# EAGLE design card (EAGLE 7.7.0)
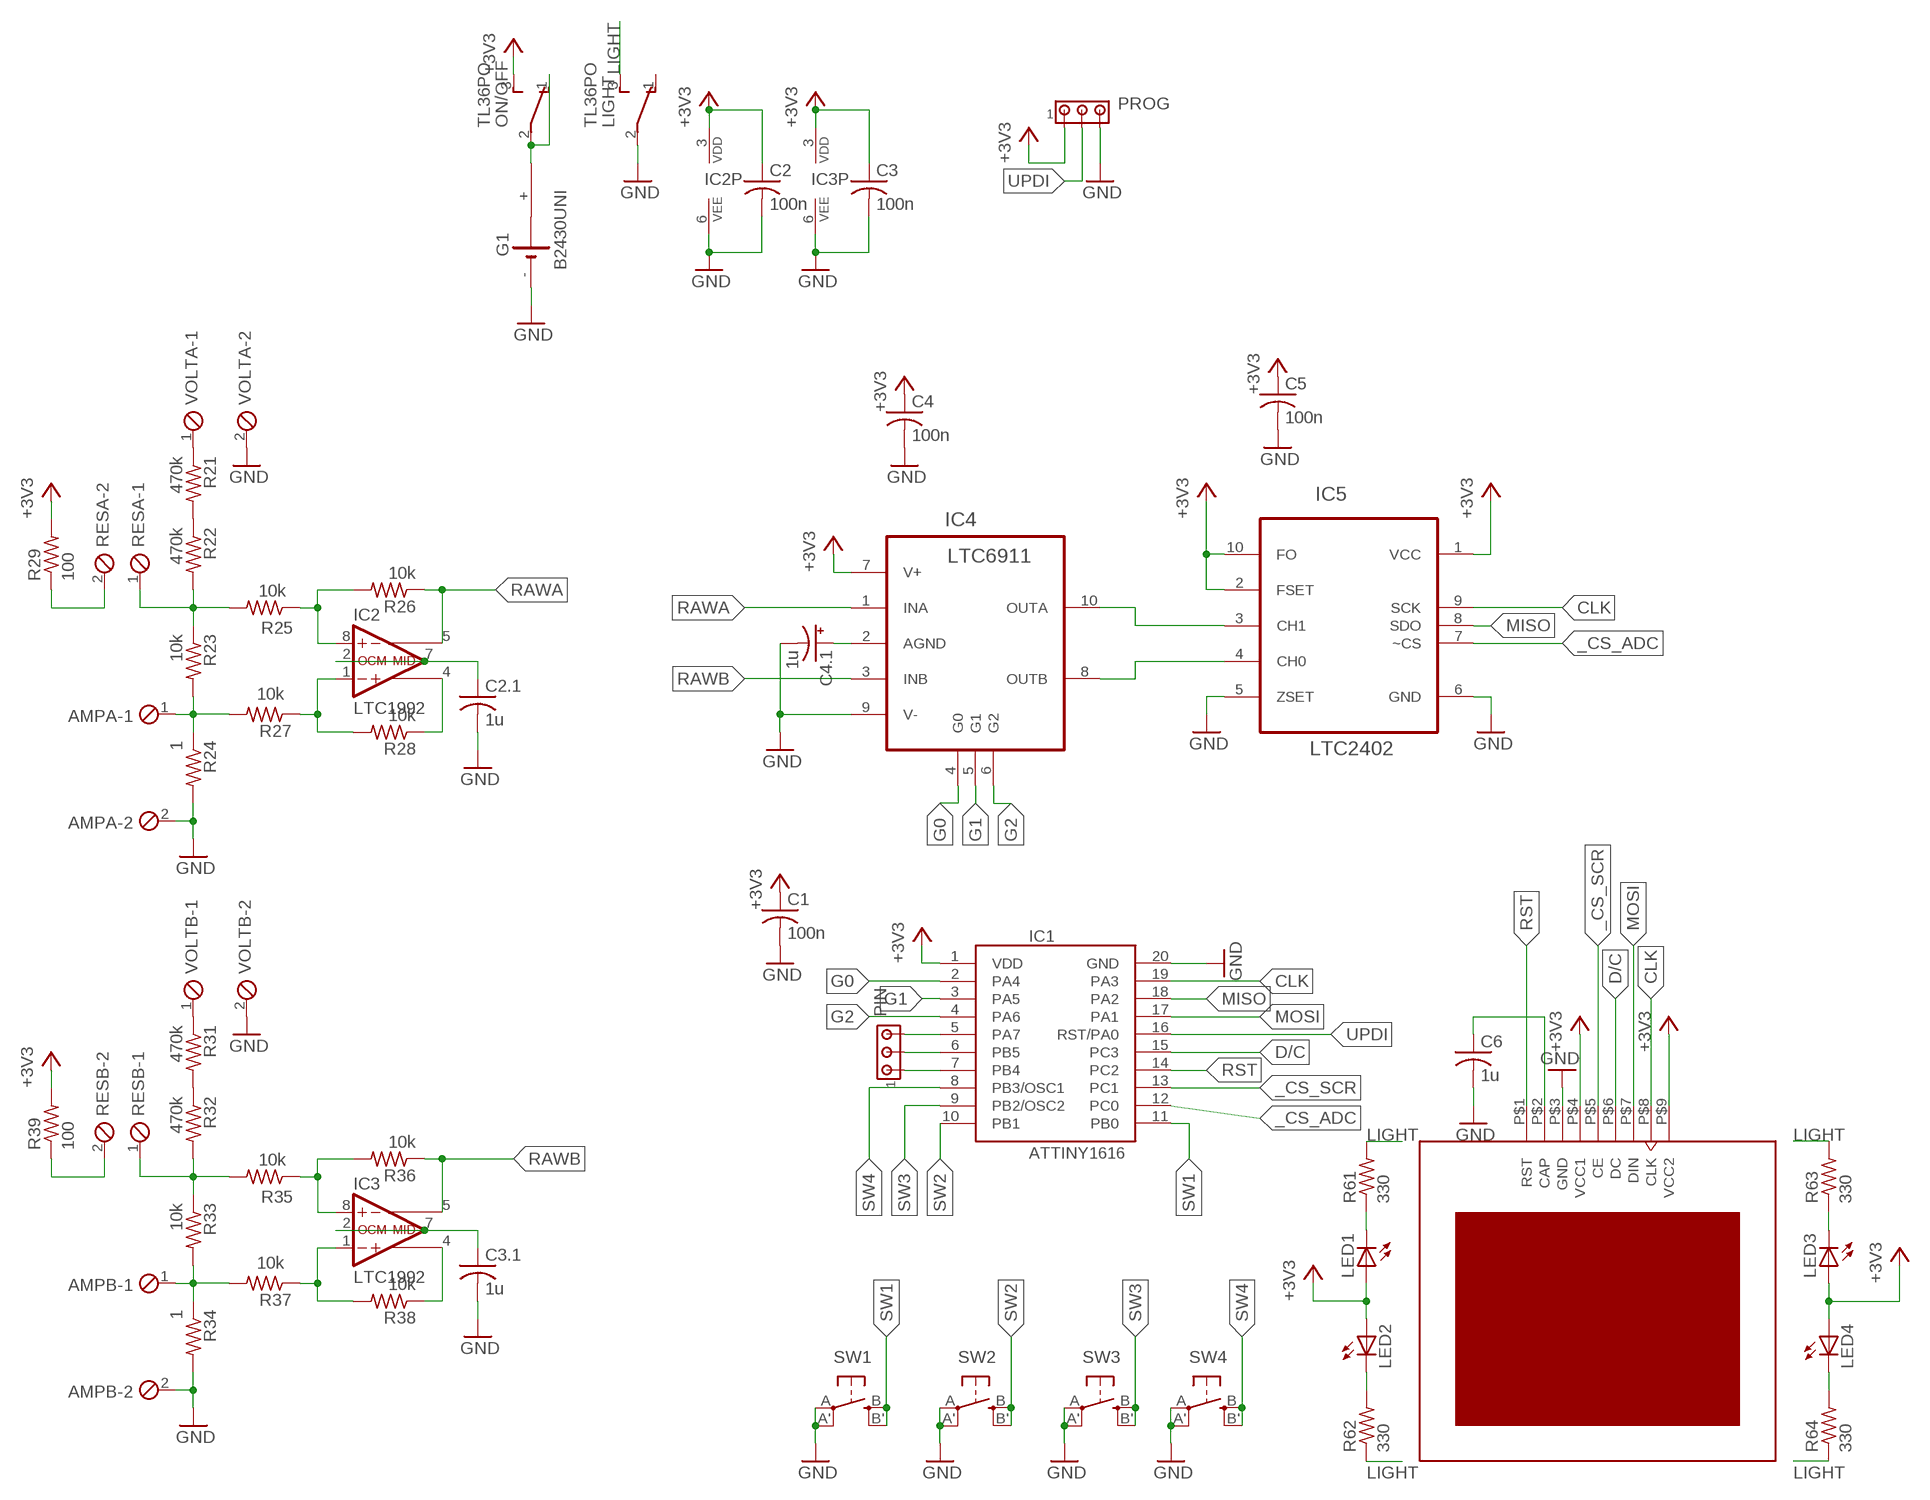
[diagram p0: schematic, sheet 1]

## Parts
AMPA  MPT2  [2POL254]
AMPB  MPT2  [2POL254]
C1  100n  C-USC0805K  [C0805K]
C2  100n  C-USC0805K  [C0805K]
C2.1  1u  C-USC0805  [C0805]
C3  100n  C-USC0805K  [C0805K]
C3.1  1u  C-USC0805  [C0805]
C4  100n  C-USC0805K  [C0805K]
C4.1  1u  CPOL-USA/3216-18R  [A/3216-18R]
C5  100n  C-USC0805K  [C0805K]
C6  1u  C-USC0805  [C0805]
G1  B2430UNI  [B2430UNI]
IC1  ATTINY1616  [SO20W]
IC2  LTC1992  LTC1992CMS8  [MSOP8]
IC3  LTC1992  LTC1992CMS8  [MSOP8]
IC4  LTC6911  LTC6911CMS-1  [MSOP10]
IC5  LTC2402  LTC2402CMS  [MSOP10]
LED1  LEDCHIP-LED0805  [CHIP-LED0805]
LED2  LEDCHIP-LED0805  [CHIP-LED0805]
LED3  LEDCHIP-LED0805  [CHIP-LED0805]
LED4  LEDCHIP-LED0805  [CHIP-LED0805]
LIGHT  TL36PO  [TL3XPO]
ON/OFF  TL36PO  [TL3XPO]
PIN  MTA03-100  [10X03MTA]
PROG  MTA03-100  [10X03MTA]
R21  470k  R-US_M0805  [M0805]
R22  470k  R-US_M0805  [M0805]
R23  10k  R-US_M0805  [M0805]
R24  1  R-US_M0805  [M0805]
R25  10k  R-US_M0805  [M0805]
R26  10k  R-US_M0805  [M0805]
R27  10k  R-US_M0805  [M0805]
R28  10k  R-US_M0805  [M0805]
R29  100  R-US_M0805  [M0805]
R31  470k  R-US_M0805  [M0805]
R32  470k  R-US_M0805  [M0805]
R33  10k  R-US_M0805  [M0805]
R34  1  R-US_M0805  [M0805]
R35  10k  R-US_M0805  [M0805]
R36  10k  R-US_M0805  [M0805]
R37  10k  R-US_M0805  [M0805]
R38  10k  R-US_M0805  [M0805]
R39  100  R-US_M0805  [M0805]
R61  330  R-US_M0805  [M0805]
R62  330  R-US_M0805  [M0805]
R63  330  R-US_M0805  [M0805]
R64  330  R-US_M0805  [M0805]
RESA  MPT2  [2POL254]
RESB  MPT2  [2POL254]
SW1  SPST_TACT-EVQQ2  [EVQ-Q2]
SW2  SPST_TACT-EVQQ2  [EVQ-Q2]
SW3  SPST_TACT-EVQQ2  [EVQ-Q2]
SW4  SPST_TACT-EVQQ2  [EVQ-Q2]
U$1  NOKIA_SCREEN  [NOKIA_SCREEN]
VOLTA  MPT2  [2POL254]
VOLTB  MPT2  [2POL254]

## Nets
+3V3: C1.1 C2.1 C3.1 C4.1 C5.1 IC1.1(VDD) IC2.3(VDD) IC3.3(VDD) IC4.7(V+) IC5.1(VCC) IC5.2(FSET) IC5.10(FO) LED1.A LED2.A LED3.A LED4.A ON/OFF.3(S) PROG.1 R29.2 R39.2 U$1.P$4(VCC1) U$1.P$9(VCC2)
_CS_ADC: IC1.12(PC0) IC5.7(~CS)
_CS_SCR: IC1.13(PC1) U$1.P$5(CE)
CLK: IC1.19(PA3) IC5.9(SCK) U$1.P$8(CLK)
D/C: IC1.15(PC3) U$1.P$6(DC)
G0: IC1.2(PA4) IC4.4(G0)
G1: IC1.3(PA5) IC4.5(G1)
G2: IC1.4(PA6) IC4.6(G2)
GND: AMPA.2 AMPB.2 C1.2 C2.1.2 C2.2 C3.1.2 C3.2 C4.1.- C4.2 C5.2 C6.2 G1.- IC1.20(GND) IC2.6(VEE) IC3.6(VEE) IC4.9(V-) IC5.5(ZSET) IC5.6(GND) LIGHT.2(P) PROG.3 R24.2 R34.2 SW1.A'(P1) SW1.A(P) SW2.A'(P1) SW2.A(P) SW3.A'(P1) SW3.A(P) SW4.A'(P1) SW4.A(P) U$1.P$3(GND) VOLTA.2 VOLTB.2
LIGHT: LIGHT.3(S) R61.2 R62.1 R63.2 R64.1
MISO: IC1.18(PA2) IC5.8(SDO)
MOSI: IC1.17(PA1) U$1.P$7(DIN)
N$1: G1.+ ON/OFF.1(O) ON/OFF.2(P)
N$2: LED1.C R61.1
N$3: C6.1 U$1.P$2(CAP)
N$4: LED2.C R62.2
N$5: LED4.C R64.2
N$6: LED3.C R63.1
N$7: IC1.7(PB4) PIN.1
N$8: IC1.5(PA7) PIN.3
N$9: IC1.6(PB5) PIN.2
N$16: IC2.1(-IN) R27.1 R28.2
N$17: IC2.8(+IN) R25.1 R26.2
N$18: C4.1.+ IC4.2(AGND)
N$19: IC2.4(+OUT) R28.1
N$21: C2.1.1 IC2.2(OCM) IC2.7(MID)
N$22: R21.2 R22.1
N$23: R22.2 R23.1 R25.2 RESA.1
N$24: AMPA.1 R23.2 R24.1 R27.2
N$25: IC3.1(-IN) R37.1 R38.2
N$26: IC3.8(+IN) R35.1 R36.2
N$27: R21.1 VOLTA.1
N$28: R29.1 RESA.2
N$29: IC4.8(OUTB) IC5.4(CH0)
N$30: IC3.4(+OUT) R38.1
N$31: C3.1.1 IC3.2(OCM) IC3.7(MID)
N$32: R31.2 R32.1
N$33: R32.2 R33.1 R35.2 RESB.1
N$34: AMPB.1 R33.2 R34.1 R37.2
N$35: R31.1 VOLTB.1
N$36: R39.1 RESB.2
N$37: IC4.10(OUTA) IC5.3(CH1)
RAWA: IC2.5(-OUT) IC4.1(INA) R26.1
RAWB: IC3.5(-OUT) IC4.3(INB) R36.1
RST: IC1.14(PC2) U$1.P$1(RST)
SW1: IC1.11(PB0) SW1.B'(S1) SW1.B(S)
SW2: IC1.10(PB1) SW2.B'(S1) SW2.B(S)
SW3: IC1.9(PB2/OSC2) SW3.B'(S1) SW3.B(S)
SW4: IC1.8(PB3/OSC1) SW4.B'(S1) SW4.B(S)
UPDI: IC1.16(RST/PA0) PROG.2
Unconnected: G1.+@1(+) G1.+@2(+) G1.+@3(+) G1.+@4(+) G1.-@1(-) LIGHT.1(O)

## Library data of the parts
AMPA AMPB RESA RESB VOLTA VOLTB = con-phoenix-254:MPT2: PHOENIX CONNECTOR; OC_FARNELL: unknown; OC_NEWARK: unknown
C1-C5 = adafruit:C-US: CAPACITOR, American symbol
C2.1 C3.1 C6 = resistor:C-US: CAPACITOR, American symbol
C4.1 = adafruit:CPOL-US: POLARIZED CAPACITOR, American symbol
G1 = battery:B2430UNI: LI BATTERY
IC1 = HomeMade:ATTINY1616
IC2 IC3 = linear-technology-2:LTC1992*: Low Power, Fully Differential Input/Output Amplifier/Driver
IC4 = HomeMade:LTC6911CMS-1
IC5 = HomeMade:LTC2402CMS
LED1-LED4 = adafruit:LED: LED OSRAM: - CHIPLED LG R971, LG N971, LY N971, LG Q971, LY Q971, LO R971, LY R971 LH N974, LH R974 LS Q976, LO Q976, LY Q976 LO Q996 - Hyper CHIPLED LW Q18S LB Q993, LB Q99A, LB R99A - SideLED LS A670, LO A670, LY A670, LG A670, LP A670 LB A673, LV A673, LT A673, LW A673 LH A674 LY A675 LS A676, LA A676, LO A676, LY A676, LW A676 LS A679, LY A679, LG A679 - Hyper Micro SIDELED® LS Y876, LA Y876, LO Y876, LY Y876 LT Y87S - SmartLED LW L88C, LW L88S LB L89C, LB L89S, LG L890 LS L89K, LO L89K, LY L89K LS L896, LA L896, LO L896, LY L896 - TOPLED LS T670, LO T670, LY T670, LG T670, LP T670 LSG T670, LSP T670, LSY T670, LOP T670, LYG T670 LG T671, LOG T671, LSG T671 LB T673, LV T673, LT T673, LW T673 LH T674 LS T676, LA T676, LO T676, LY T676, LB T676, LH T676, LSB T676, LW T676 LB T67C, LV T67C, LT T67C, LS T67K, LO T67K, LY T67K, LW E67C LS E67B, LA E67B, LO E67B, LY E67B, LB E67C, LV E67C, LT E67C LW T67C LS T679, LY T679, LG T679 LS T770, LO T770, LY T770, LG T770, LP T770 LB T773, LV T773, LT T773, LW T773 LH T774 LS E675, LA E675, LY E675, LS T675 LS T776, LA T776, LO T776, LY T776, LB T776 LHGB T686 LT T68C, LB T68C - Hyper Mini TOPLED® LB M676 - Mini TOPLED Santana® LG M470 LS M47K, LO M47K, LY M47K Source: http://www.osram.convergy.de/
LIGHT ON/OFF = switch:TL36PO: TINY SWITCH ON - ON Source: http://www2.produktinfo.conrad.com/datenblaetter/700000-724999/705152-da-01-de-Subminiaturschalter_TL_36YO.pdf
PIN PROG = con-amp:MTA03-100: AMP connector
R21-R29 R31-R39 R61-R64 = resistor:R-US_: RESISTOR, American symbol
SW1-SW4 = adafruit:SPST_TACT: SMT 6mm switch, EVQQ2 series http://www.ladyada.net/library/eagle
U$1 = HomeMade:NOKIA_SCREEN

## Board
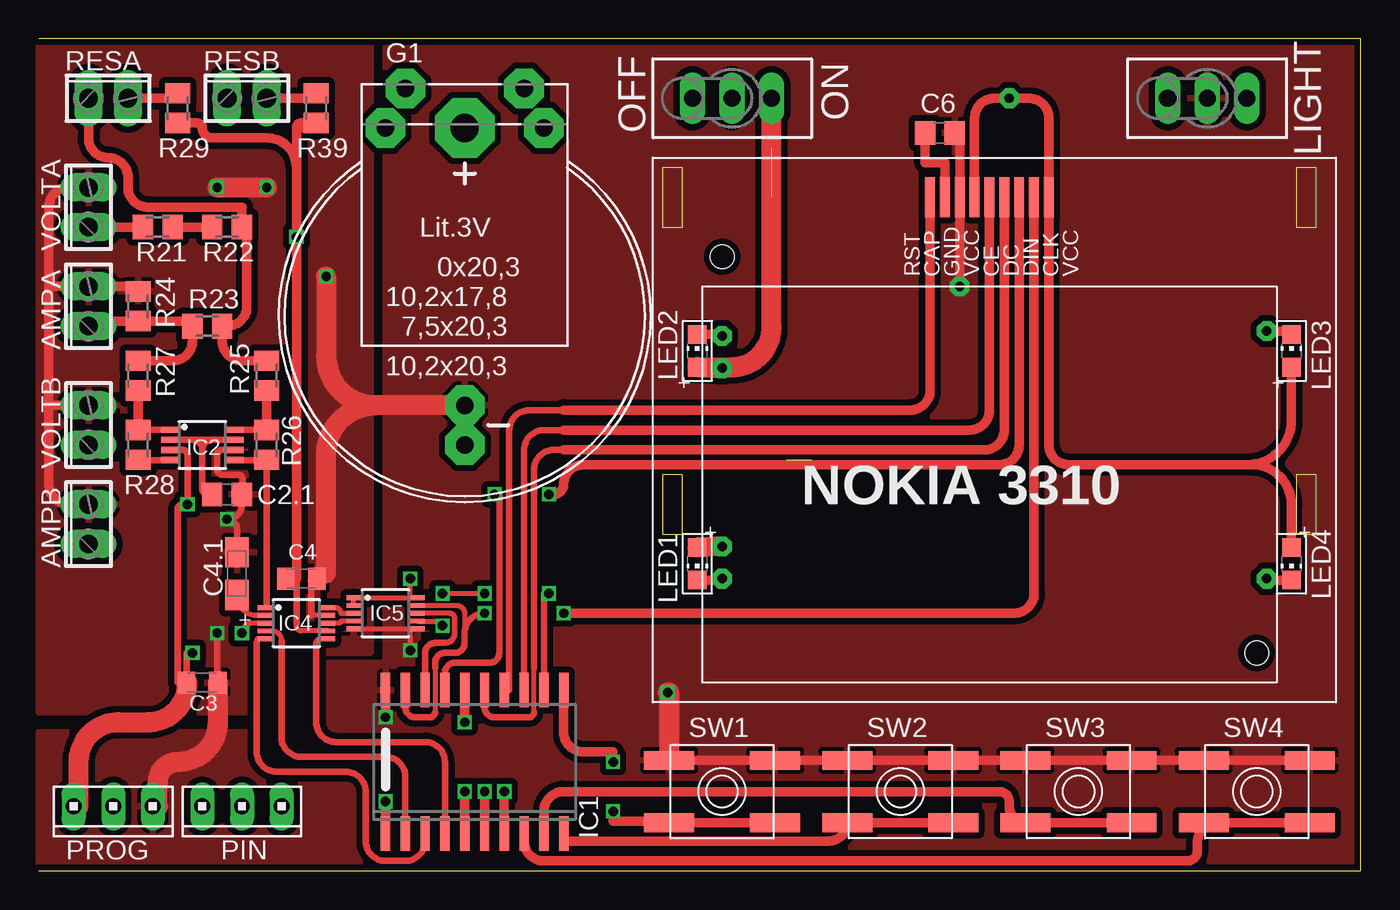
[diagram p1: board, top side]
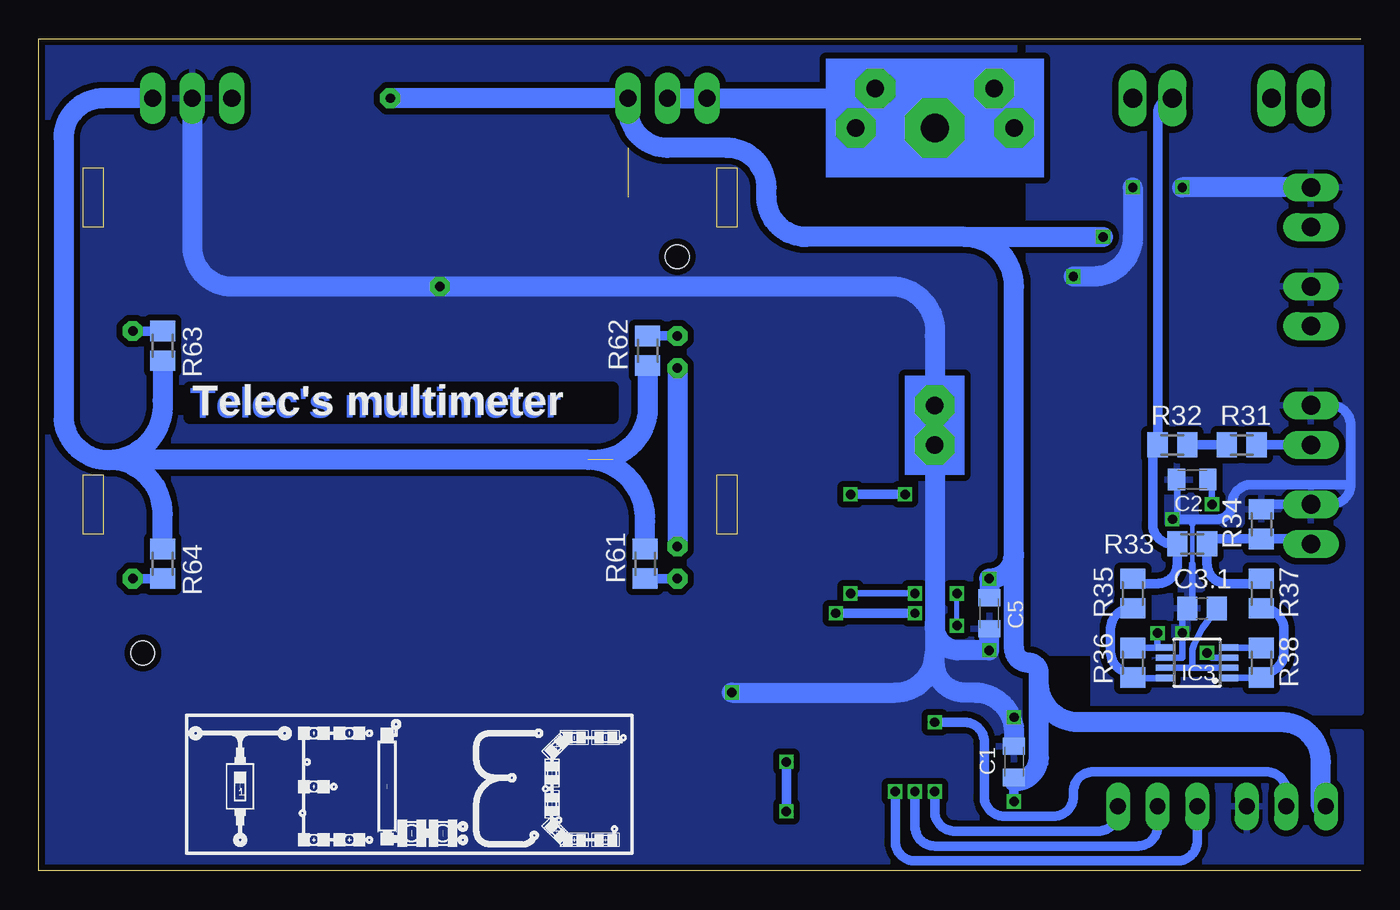
[diagram p2: board, bottom side, seen from below]

Size 84.76 x 53.33 mm. Coordinates in mm from the lower left corner, seen from the top.
Outline: 0,0 84.76,0 84.76,53.33 0,53.33
Copper layers (1*16): Top 0.035mm / dielectric 1.5mm / Bottom 0.035mm
Design rules "Cirly": minimum track width 6mil, minimum drill 0.3mm, track to track 6mil, track to pad 6mil, pad to pad 6mil, via to via 6mil, smd to smd 6mil, copper to edge 6mil, drill to drill 8mil, minimum pad ring 6mil, minimum via ring 6mil, stop-mask expansion 4mil, vias tented up to drill 0mil, thermal gap 10mil

### Footprints (pad centres in the part's own frame; a part is rotated, then mirrored left to right if it is on the bottom)
2POL254 = drill 1.2 long: 1 -1.27,0; 2 1.27,0
C0805K = smd 1.1 x 1.4: 1 -1,0; 2 1,0
C0805 = smd 1.3 x 1.5: 1 -0.95,0; 2 0.95,0
A/3216-18R = smd 1.95 x 1.5: + 1.375,0; - -1.375,0
B2430UNI = drill 1.118 pad 2.54 octagon: + 3.81,14.605; +@1 -3.81,14.605; +@2 -5.08,12.065; +@3 5.08,12.065; - 0,-5.715; -@1 0,-8.255 | drill 1.803 pad 3.81 octagon: +@4 0,12.065
SO20W = smd 0.6 x 2.2: 1 -5.715,-4.6; 2 -4.445,-4.6; 3 -3.175,-4.6; 4 -1.905,-4.6; 5 -0.635,-4.6; 6 0.635,-4.6; 7 1.905,-4.6; 8 3.175,-4.6; 9 4.445,-4.6; 10 5.715,-4.6; 11 5.715,4.6; 12 4.445,4.6; 13 3.175,4.6; 14 1.905,4.6; 15 0.635,4.6; 16 -0.635,4.6; 17 -1.905,4.6; 18 -3.175,4.6; 19 -4.445,4.6; 20 -5.715,4.6
MSOP8 = smd 0.4 x 1.2: 1 -0.975,-2.05; 2 -0.325,-2.05; 3 0.325,-2.05; 4 0.975,-2.05; 5 0.975,2.05; 6 0.325,2.05; 7 -0.325,2.05; 8 -0.975,2.05
MSOP10 = smd 0.31 x 0.9: 1 -1,-2.05; 2 -0.5,-2.05; 3 0,-2.05; 4 0.5,-2.05; 5 1,-2.05; 6 1,2.05; 7 0.5,2.05; 8 0,2.05; 9 -0.5,2.05; 10 -1,2.05
CHIP-LED0805 = smd 1.2 x 1.2: A 0,-1.05; C 0,1.05
TL3XPO = drill 1.1 pad 1.422 long: 1 -2.54,0; 2 0,0; 3 2.54,0
10X03MTA = drill 1.016 long: 1 2.54,0; 2 0,0; 3 -2.54,0
M0805 = smd 1.3 x 1.6: 1 -0.95,0; 2 0.95,0
EVQ-Q2 = smd 3.2 x 1.2: A -3.4,-2; A' 3.4,-2; B -3.4,2; B' 3.4,2
NOKIA_SCREEN = smd 0.635 x 2.54: P$1 17.78,32.385; P$2 18.733,32.385; P$3 19.685,32.385; P$4 20.637,32.385; P$5 21.59,32.385; P$6 22.543,32.385; P$7 23.495,32.385; P$8 24.448,32.385; P$9 25.4,32.385 | hole 1.524: 38.735,3.175; 4.445,28.575

### Placement (x,y rotation side)
AMPA  3.17,36.2 90 top
AMPB  3.17,22.23 90 top
C1  22.23,6.99 90 bottom
C2  10.79,25.08 180 bottom
C2.1  12.06,24.13 0 top
C3  10.48,12.06 0 top
C3.1  10.16,16.83 180 bottom
C4  16.83,18.73 0 top
C4.1  12.7,19.05 270 top
C5  23.81,16.51 270 bottom
C6  57.78,47.31 0 top
G1  27.3,35.56 0 top
IC1  27.94,6.99 0 top
IC2  10.48,27.3 270 top
IC3  10.48,13.34 90 bottom
IC4  16.51,15.88 270 top
IC5  22.23,16.51 270 top
LED1  42.23,19.68 180 top
LED2  42.23,33.34 0 top
LED3  80.33,33.34 0 top
LED4  80.33,19.68 180 top
LIGHT  74.93,49.53 0 top
ON/OFF  44.45,49.53 0 top
PIN  13.02,4.13 180 top
PROG  4.76,4.13 180 top
R21  7.62,41.27 0 top
R22  12.06,41.27 0 top
R23  10.79,34.92 180 top
R24  6.35,36.2 90 top
R25  14.61,31.75 90 top
R26  14.61,27.3 90 top
R27  6.35,31.75 90 top
R28  6.35,27.3 90 top
R29  8.89,48.9 270 top
R31  7.62,27.3 180 bottom
R32  12.06,27.3 180 bottom
R33  10.79,20.95 0 bottom
R34  6.35,22.23 90 bottom
R35  14.61,17.78 90 bottom
R36  14.61,13.34 270 bottom
R37  6.35,17.78 90 bottom
R38  6.35,13.34 270 bottom
R39  17.78,48.9 270 top
R61  45.88,19.68 90 bottom
R62  45.72,33.34 90 bottom
R63  76.83,33.66 270 bottom
R64  76.83,19.68 270 bottom
RESA  4.45,49.53 0 top
RESB  13.34,49.53 0 top
SW1  43.81,5.08 180 top
SW2  55.24,5.08 180 top
SW3  66.67,5.08 180 top
SW4  78.11,5.08 180 top
U$1  39.37,10.79 0 top
VOLTA  3.17,42.55 90 top
VOLTB  3.17,28.57 90 top

### Tracks (layer width: path | path; a pad name or v marks a point on that pad's centre or on a via)
+3V3  (via drill 0.6, 0.6 pad 1.27)  (1 unrouted)
  Top 0.33: IC4.7 16.83,15.38 arc-90 16.51,15.69 16.51,15.88 | IC5.2 IC5.1 C5.1 | IC5.10 C5.1 | C5.1 v23.81,18.73
  Top 0.406: 17.78,47.62 R39.2 | C4.1 16.19,18.73 | v9.84,13.97 9.48,13.97 C3.1 8.89,12.06 8.89,23.18 arc-90 9.21,23.5 v9.53,23.5 9.53,26.66 arc90 9.21,26.98 IC2.3 | 16.51,15.88 16.51,18.73
  Top 0.61: 77.47,26.04 77.79,26.04 arc-90 80.33,23.5 LED4.A | 77.47,26.04 66.04,26.04 arc-90 64.77,27.3 U$1.P$9 64.77,48.26 arc90 63.5,49.53 v62.23,49.53 61.28,49.53 arc90 60.01,48.26 U$1.P$4 | R39.2 16.83,47.95 arc90 16.51,47.62 | R29.2 10.16,47.95 arc-90 10.48,47.62 arc90 11.11,46.99 14.61,46.99 arc-90 16.51,45.09 | 17.78,47.62 16.51,47.62 | 16.51,47.62 16.51,45.09 | 16.51,45.09 v16.51,40.64 16.51,18.73 16.19,18.73 | IC1.1 v22.23,4.45 | LED3.A 80.33,28.89 arc-90 77.47,26.04
  Top 1.27: v43.81,32.23 LED2.A 44.45,32.29 arc90 46.99,34.83 ON/OFF.3 | v43.81,20.8 LED1.A | PROG.1 2.54,4.13 2.54,6.99 arc-90 5.08,9.53 6.99,9.53 arc90 9.53,12.06 C3.1
  Bottom 0.406: IC3.3 9.53,13.66 v9.84,13.97 | v9.53,23.5 9.53,25.4 9.79,25.4 C2.1
  Bottom 0.61: v22.23,4.45 22.23,5.71 C1.1 | 23.5,17.51 C5.1 v23.81,18.73
  Bottom 1.27: v62.23,49.53 ON/OFF.3 46.99,48.9 arc-90 44.45,46.35 40.64,46.35 arc90 38.1,43.81 38.1,43.18 arc-90 35.56,40.64 25.4,40.64 | v43.81,32.23 v43.81,20.8 | 25.4,40.64 v16.51,40.64 | 22.23,5.71 arc-90 20.64,7.3 20.64,12.06 | PROG.1 2.54,4.13 2.54,6.99 arc-90 5.08,9.53 18.1,9.53 arc90 20.64,12.06 | 23.81,17.78 v23.81,18.73 arc-90 22.23,20.32 | 22.23,20.32 22.23,37.47 arc-90 25.4,40.64 | 20.64,12.06 20.64,12.7 arc-90 21.27,13.34 arc90 22.23,14.29 22.23,20.32
_CS_ADC  (via drill 0.6)
  Top 0.33: IC5.7 25.88,16.01 v25.88,15.72 | v25.88,17.78 v28.57,17.78
  Top 0.406: IC1.12 32.38,17.78 v32.7,17.78
  Bottom 0.33: v25.88,15.72 v25.88,17.78
  Bottom 0.406: v32.7,17.78 v28.57,17.78
_CS_SCR
  Top 0.406: 33.66,28.26 32.38,28.26 arc90 31.11,26.99 IC1.13
  Top 0.61: 33.66,28.26 59.69,28.26 arc90 60.96,29.53 U$1.P$5
CLK  (via drill 0.6)
  Top 0.33: IC5.9 26.8,17.01 arc-90 27.3,16.51 27.3,15.24 | 25.4,13.02 25.4,10.16
  Top 0.406: 25.4,13.02 25.4,13.34 arc-90 26.04,13.97 26.67,13.97 arc90 27.3,14.61 27.3,15.24 arc-90 v28.57,16.51 | 25.4,10.16 arc-90 25.08,9.84 24.13,9.84 arc-90 23.5,10.48 IC1.19
  Top 0.61: v33.66,16.51 62.55,16.51 arc90 63.82,17.78 U$1.P$8
  Bottom 0.61: v33.66,16.51 v28.57,16.51
D/C
  Top 0.33: 31.75,10.16 31.75,13.02
  Top 0.406: IC1.15 28.57,10.48 arc90 29.21,9.84 31.43,9.84 arc90 31.75,10.16 | 31.75,13.02 31.75,25.72 arc-90 33.02,26.99 33.66,26.99
  Top 0.61: 33.66,26.99 60.64,26.99 arc90 61.91,28.26 U$1.P$6
G0
  Top 0.33: IC4.4 14.95,15.38 arc-90 15.56,14.76
  Top 0.406: IC1.2 23.5,6.03 arc90 22.23,7.3 16.83,7.3 arc-90 15.56,8.57 15.56,14.76
G1
  Top 0.33: IC4.5 13.97,14.88 13.97,14.61
  Top 0.406: 13.97,14.61 13.97,7.62 arc90 15.24,6.35 19.68,6.35 arc-90 20.95,5.08 20.95,1.91 arc90 22.23,0.64 23.5,0.64 arc90 24.77,1.91 IC1.3
G2
  Top 0.33: IC4.6 18.05,14.88 arc90 17.78,14.61
  Top 0.406: 17.78,14.61 17.78,9.53 arc90 19.05,8.26 24.77,8.26 arc-90 26.04,6.99 IC1.4
GND  (via drill 0.6, 0.6 pad 1.27)
  Top 0.33: IC4.9 17.46,16.38 | IC5.5 C5.2 | IC5.6 C5.2 | C5.2 v23.81,14.13
  Top 0.406: IC2.6 11.75,26.98 arc90 11.43,26.66 11.43,25.72 arc90 11.75,25.4 12.75,25.4 arc-93 13.06,25.07 C2.1.2 13.02,23.5 arc-90 v12.06,22.54 arc-90 12.7,21.91 C4.1.- 12.7,20.32 | 17.46,16.38 17.46,18.73 C4.2 | C3.2 11.43,12.06 v11.43,15.24
  Top 0.61: v59.05,37.47 U$1.P$3 59.05,47.31 C6.2 | SW4.A SW4.A' SW3.A SW3.A' | SW3.A' 62.87,7.08 62.87,6.99 63.27,6.99 SW3.A' | SW3.A' SW2.A SW2.A' SW1.A SW1.A' | 0.64,37.47 0.64,42.55 arc-90 1.91,43.81 VOLTA.2 | R24.2 6.35,37.47 AMPA.2 0.64,37.47 | 0.64,37.47 0.64,29.84 | VOLTB.2 0.64,29.84 | 0.64,29.84 0.64,24.77 arc90 1.91,23.5 AMPB.2 | 27.3,28.57 G1.- | v22.23,9.84 IC1.20 | 18.41,18.73 C4.2
  Top 1.27: PROG.3 7.62,4.13 7.62,5.67 arc-90 8.94,6.99 arc90 11.48,9.53 C3.2 | v40.32,11.43 40.41,11.43 SW1.A' | v11.43,43.81 v14.61,43.81 | G1.- 21.59,29.84 | 21.59,29.84 20.95,29.84 | v18.41,38.1 18.41,33.02 arc90 21.59,29.84 | 18.41,19.05 18.41,26.67 arc-90 21.59,29.84
  Bottom 0.279: 10.79,19.68 10.79,22.23
  Bottom 0.406: IC3.6 11.43,13.66 v11.43,15.24 | v11.43,15.24 11.43,16.51 | 11.43,16.51 11.43,16.83 10.79,16.83 10.79,19.68 | 10.79,22.23 10.79,22.54 | 11.43,16.51 C3.1.2 11.43,16.83 v11.43,15.24 | C2.2 11.75,24.77 11.75,22.54 v12.06,22.54
  Bottom 0.61: VOLTB.2 1.91,29.84 arc90 0.64,28.57 0.64,24.77 | 0.64,24.77 arc90 1.91,23.5 AMPB.2 6.35,23.5 R34.2 | 0.64,24.77 6.99,24.77 arc-90 8.26,23.5 arc90 9.21,22.54 10.79,22.54 v12.06,22.54 | C1.2 22.23,8.26 v22.23,9.84 | 23.81,14.92 C5.2
  Bottom 1.27: LIGHT.2 74.93,40.01 arc-90 72.39,37.47 v59.05,37.47 29.84,37.47 arc90 27.3,34.29 G1.- 27.3,15.88 | 27.3,15.88 27.3,13.97 | 27.3,13.97 27.3,13.34 arc-90 25.4,11.43 24.77,11.43 arc90 22.23,8.89 22.23,8.26 | VOLTA.2 v11.43,43.81 | v14.61,43.81 14.61,40.64 arc90 17.14,38.1 v18.41,38.1 | 23.81,14.92 v23.81,14.13 25.88,14.13 arc90 27.3,15.88 | v40.32,11.43 29.84,11.43 arc-90 27.3,13.97
  pour Top (isolate 0.406): 0,53.34 21.27,53.34 21.27,13.97 17.14,13.97 17.14,10.16 0,10.16
  pour Bottom (isolate 0.406): 0,53.34 21.27,53.34 21.27,13.97 17.14,13.97 17.14,10.16 0,10.16
  pour Top (isolate 0.406): 0,8.89 0,0 85.09,0 85.09,53.34 22.23,53.34 22.23,13.34 18.41,13.34 18.41,8.89
  pour Bottom (isolate 0.406): 85.09,0 85.09,53.34 22.23,53.34 22.23,13.34 18.41,13.34 18.41,8.89 0,8.89 0,0
LIGHT  (1 unrouted)
  Bottom 1.27: 49.53,26.35 80.01,26.35 | LIGHT.3 80.64,49.53 arc-90 83.19,46.99 83.19,28.89 arc-90 80.01,26.35 | R63.2 76.83,30.16 arc90 80.01,26.35 | R64.1 76.83,22.54 arc-90 80.01,26.35 | R62.1 45.72,29.37 arc90 49.53,26.35 | R61.2 45.88,22.38 arc-90 49.53,26.35
MISO
  Top 0.33: 26.67,16.19 arc90 26.35,16.51 IC5.8
  Top 0.356: 26.04,14.61 arc90 26.67,15.24 26.67,16.19
  Top 0.406: IC1.18 24.77,13.97 arc-90 25.4,14.61 26.04,14.61
MOSI  (via drill 0.6)
  Top 0.406: IC1.17 26.04,12.7 arc-90 26.67,13.34 28.89,13.34 arc90 29.53,13.97 29.53,24.13 v29.21,24.13
  Top 0.61: v32.7,24.13 33.02,24.13 arc90 33.66,24.77 arc-90 34.92,26.04 61.59,26.04 arc90 62.87,27.3 U$1.P$7
  Bottom 0.61: v29.21,24.13 v32.7,24.13
N$1
  Bottom 1.27: ON/OFF.2 ON/OFF.1 30.48,49.53 G1.+
N$2  (via drill 0.6 pad 1.27)
  Top 0.61: LED1.C 43.81,18.64 v43.81,18.73
  Bottom 0.61: v43.81,18.73 45.4,18.73 R61.1
N$3
  Top 0.61: U$1.P$2 58.1,45.4 56.84,45.4 C6.1
N$4  (via drill 0.6 pad 1.27)
  Top 0.61: LED2.C 43.5,34.39 v43.81,34.29
  Bottom 0.61: v43.81,34.29 45.4,34.29 R62.2
N$5  (via drill 0.6 pad 1.27)
  Top 0.61: LED4.C 79.06,18.64 v78.74,18.73
  Bottom 0.61: v78.74,18.73 77.47,18.73 R64.2
N$6  (via drill 0.6 pad 1.27)
  Top 0.61: v78.74,34.61 80.33,34.61 LED3.C
  Bottom 0.61: R63.1 79.06,34.6 v78.74,34.61
N$7  (via drill 0.6)
  Top 0.61: IC1.7 v29.84,5.08
  Bottom 0.61: v29.84,5.08 29.84,1.91 arc-90 28.57,0.64 11.75,0.64 arc-90 10.48,1.91 PIN.1
N$8  (via drill 0.6)
  Top 0.61: IC1.5 v27.3,5.08
  Bottom 0.61: v27.3,5.08 27.3,3.81 arc-90 26.04,2.54 16.83,2.54 arc-90 15.56,3.81 PIN.3
N$9  (via drill 0.6)
  Top 0.61: IC1.6 v28.57,5.08
  Bottom 0.61: v28.57,5.08 28.57,2.86 arc-90 27.3,1.59 14.29,1.59 arc-90 13.02,2.86 PIN.2
N$16
  Top 0.406: IC2.1 6.35,28.28 R28.2
  Top 0.61: R27.1 R28.2
N$17
  Top 0.406: IC2.8 14.61,28.28 R26.2
  Top 0.61: R25.1 R26.2
N$18
  Top 0.33: IC4.2 13.97,16.38 arc-90 12.7,17.64 C4.1.+
N$19
  Top 0.406: IC2.4 6.35,26.33 R28.1
N$21
  Top 0.406: C2.1.1 10.79,24.13 arc-90 10.48,24.45 10.48,27 | IC2.7 11.11,27.63 arc90 10.48,27 | IC2.2 9.53,27.63 | 10.48,27 arc90 9.84,27.63 9.53,27.63 | 9.53,27.63 arc90 9.53,27.62 11.75,27.62
N$22
  Top 0.61: R21.2 R22.1
N$23
  Top 0.61: R25.2 13.02,32.7 arc-90 11.74,33.97 R23.1 12.06,34.92 arc90 13.34,36.2 13.34,41.27 R22.2 13.02,42.55 | RESA.1 3.17,46.99 arc90 4.45,45.72 arc-90 5.71,44.45 5.71,43.81 arc90 6.99,42.55 13.02,42.55 | 13.02,42.55
N$24
  Top 0.61: R24.1 9.85,35.24 R23.2 9.85,33.97 arc-90 8.57,32.7 R27.2 | 6.35,34.92 R24.1 | R24.1 3.17,35.24 AMPA.1
N$25
  Bottom 0.406: R38.2 8.26,12.38 | 8.26,12.38 8.43,12.38 | IC3.1 8.26,12.36 8.26,12.38
  Bottom 0.61: R37.1 arc90 4.92,15.56 4.92,13.81 arc90 6.35,12.7 R38.2
N$26
  Bottom 0.406: IC3.8 14.61,12.36 R36.2
  Bottom 0.61: R35.1 arc-90 16.03,15.56 16.03,13.97 arc-90 14.61,12.7 R36.2
N$27
  Top 0.61: VOLTA.1 R21.1
N$28
  Top 0.61: RESA.2 8.89,49.53 R29.1
N$29
  Top 0.33: IC4.8 19.23,15.88 arc90 19.37,16.01 IC5.4
N$30
  Bottom 0.406: R38.1 6.35,14.31 IC3.4
N$31
  Bottom 0.406: IC3.2 10.79,13.01 | 10.79,13.01 IC3.7 | C3.1.1 10.16,15.56 10.66,14.56 arc-27 10.79,13.99 10.79,13.01
N$32
  Bottom 0.61: R31.2 R32.1
N$33
  Bottom 0.61: 12.06,20.95 arc90 13.34,22.23 13.34,27.3 R32.2 13.02,48.58 arc90 RESB.1 | 12.06,20.95 R33.1 | R33.1 12.06,20.95 | R33.1 11.74,19.68 arc90 13.02,18.41 14.61,18.41 R35.2
N$34
  Bottom 0.61: R33.2 9.85,21.27 R34.1 3.17,21.27 AMPB.1 | R33.2 9.53,20.95 | R33.2 9.85,19.68 arc-90 8.57,18.41 6.35,18.41 R37.2
N$35
  Bottom 0.61: VOLTB.1 R31.1
N$36
  Top 0.61: RESB.2 17.78,49.53 R39.1
N$37
  Top 0.33: IC4.10 19,16.88 arc-90 19.37,16.51 IC5.3
RAWA
  Top 0.33: 14.61,17.14 14.61,16.88 IC4.1
  Top 0.406: R26.1 14.61,26.33 IC2.5 14.46,26.33 14.61,26.04 14.61,17.14
RAWB  (via drill 0.6)
  Top 0.33: IC4.3 13.65,15.88 arc90 v13.02,15.24
  Bottom 0.406: IC3.5 13.02,14.31 | 13.02,14.31 14.61,14.31 R36.1 | v13.02,15.24 13.02,14.31
RST
  Top 0.406: IC1.14 30.16,11.59 30.16,28.26 arc-90 31.43,29.53 33.66,29.53
  Top 0.61: 33.66,29.53 55.88,29.53 arc90 57.15,30.8 U$1.P$1
SW1  (via drill 0.6)
  Top 0.61: SW1.B SW1.B' 40.41,3.17 36.83,3.17 v36.83,3.81 | IC1.11 33.66,8.89 arc90 34.92,7.62 36.83,7.62 v36.83,6.99
  Bottom 0.61: v36.83,6.99 v36.83,3.81
SW2
  Top 0.61: SW2.B SW2.B' arc-90 50.67,1.91 33.66,1.91 IC1.10 | SW2.B 59.05,3.08 59.05,3.17 58.65,3.17 SW2.B
SW3
  Top 0.61: SW3.B' 62.87,3.08 | SW3.B' SW3.B | IC1.9 32.38,3.81 arc-90 33.66,5.08 61.59,5.08 arc-90 62.23,4.45 62.23,4.12 arc90 SW3.B'
SW4
  Top 0.61: SW4.B 75.56,3.08 | 75.56,3.08 SW4.B' | IC1.8 31.11,1.91 arc90 32.38,0.64 73.66,0.64 arc90 74.3,1.27 74.3,1.81 arc-90 75.56,3.08
UPDI  (via drill 0.6)
  Top 0.61: IC1.16 v27.3,9.53
  Bottom 0.61: v27.3,9.53 25.4,9.53 arc90 24.13,8.26 24.13,4.76 arc-90 22.86,3.49 19.68,3.49 arc-90 18.41,4.76 18.41,5.08 arc90 17.14,6.35 6.03,6.35 arc90 4.76,5.08 PROG.2
(copper drawn outside any net)
  shapes: Bottom area x2

### Text on the board
Bottom: Telec's multimeter
tPlace: ON | OFF | LIGHT
bNames: Telec's multimeter | F:/Users/Loup/Doc/eagle/Logo/logoBW.bmp
bValues: Max volt: | Max amp: